# EAGLE board xmagaboard (EAGLE 5.03), part 1 of 2
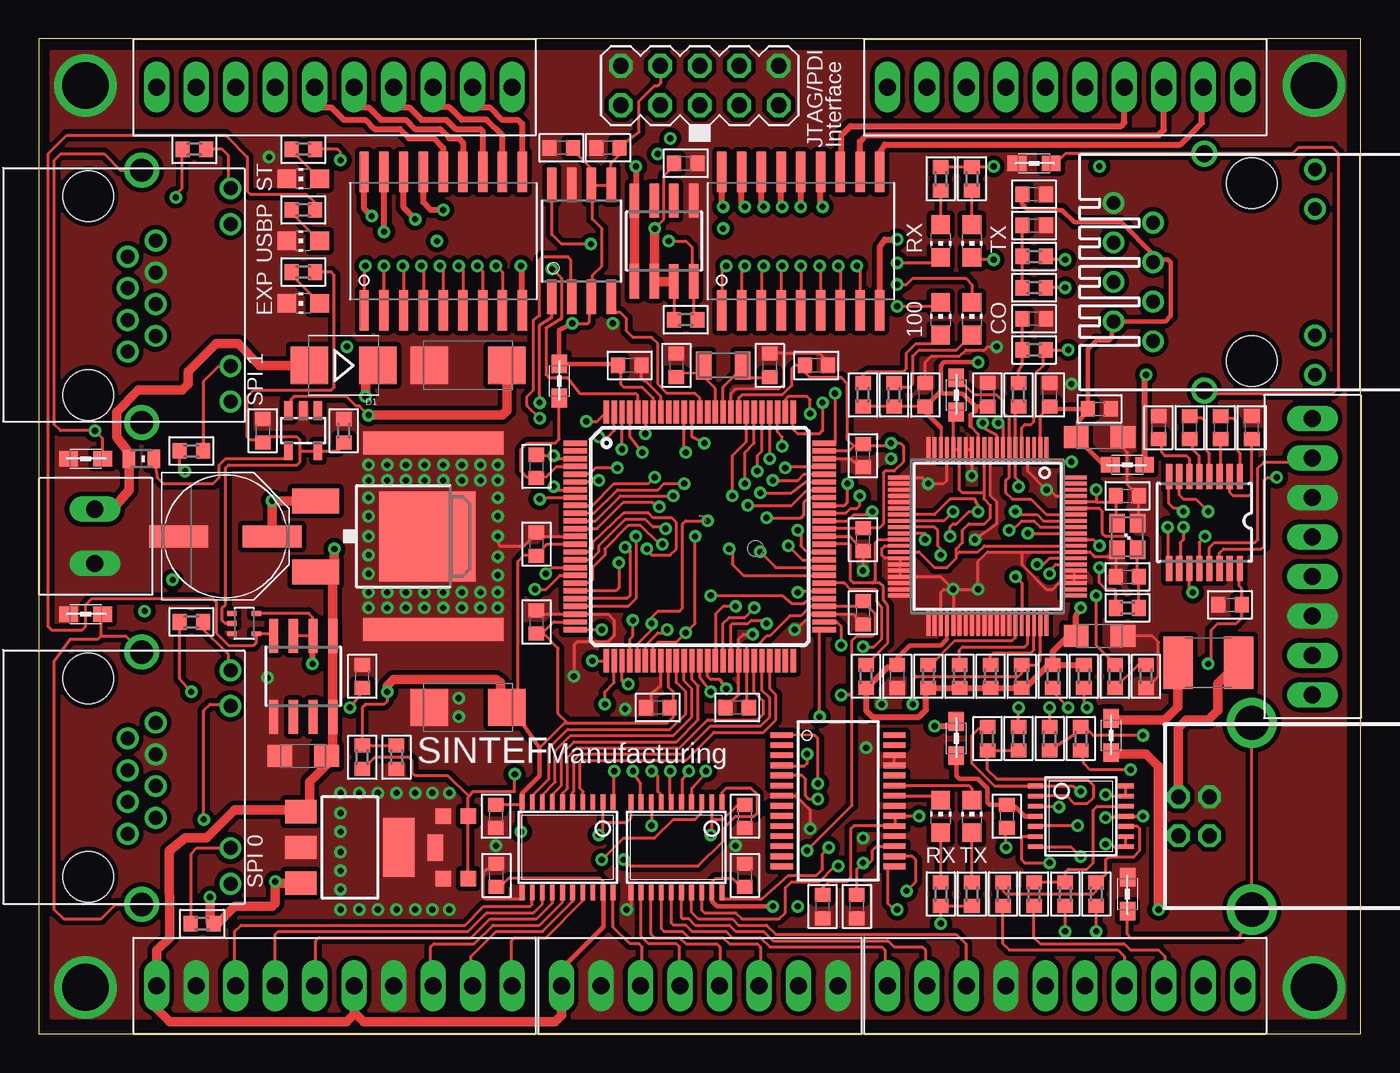
[diagram p2: board, top side]
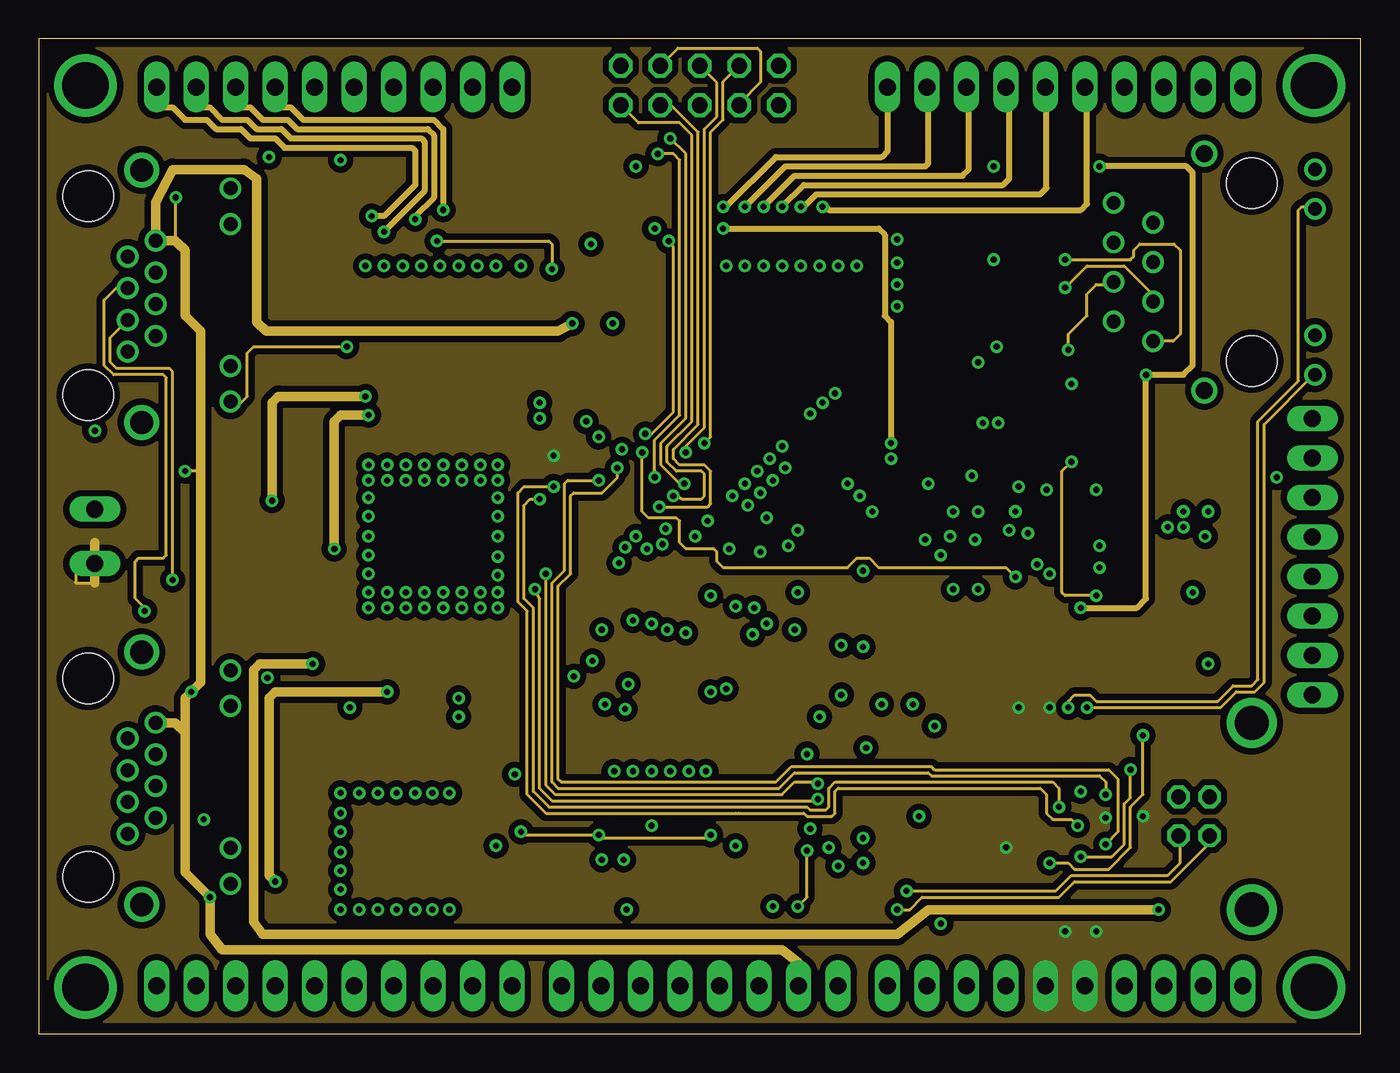
[diagram p3: board, inner layer Route2]
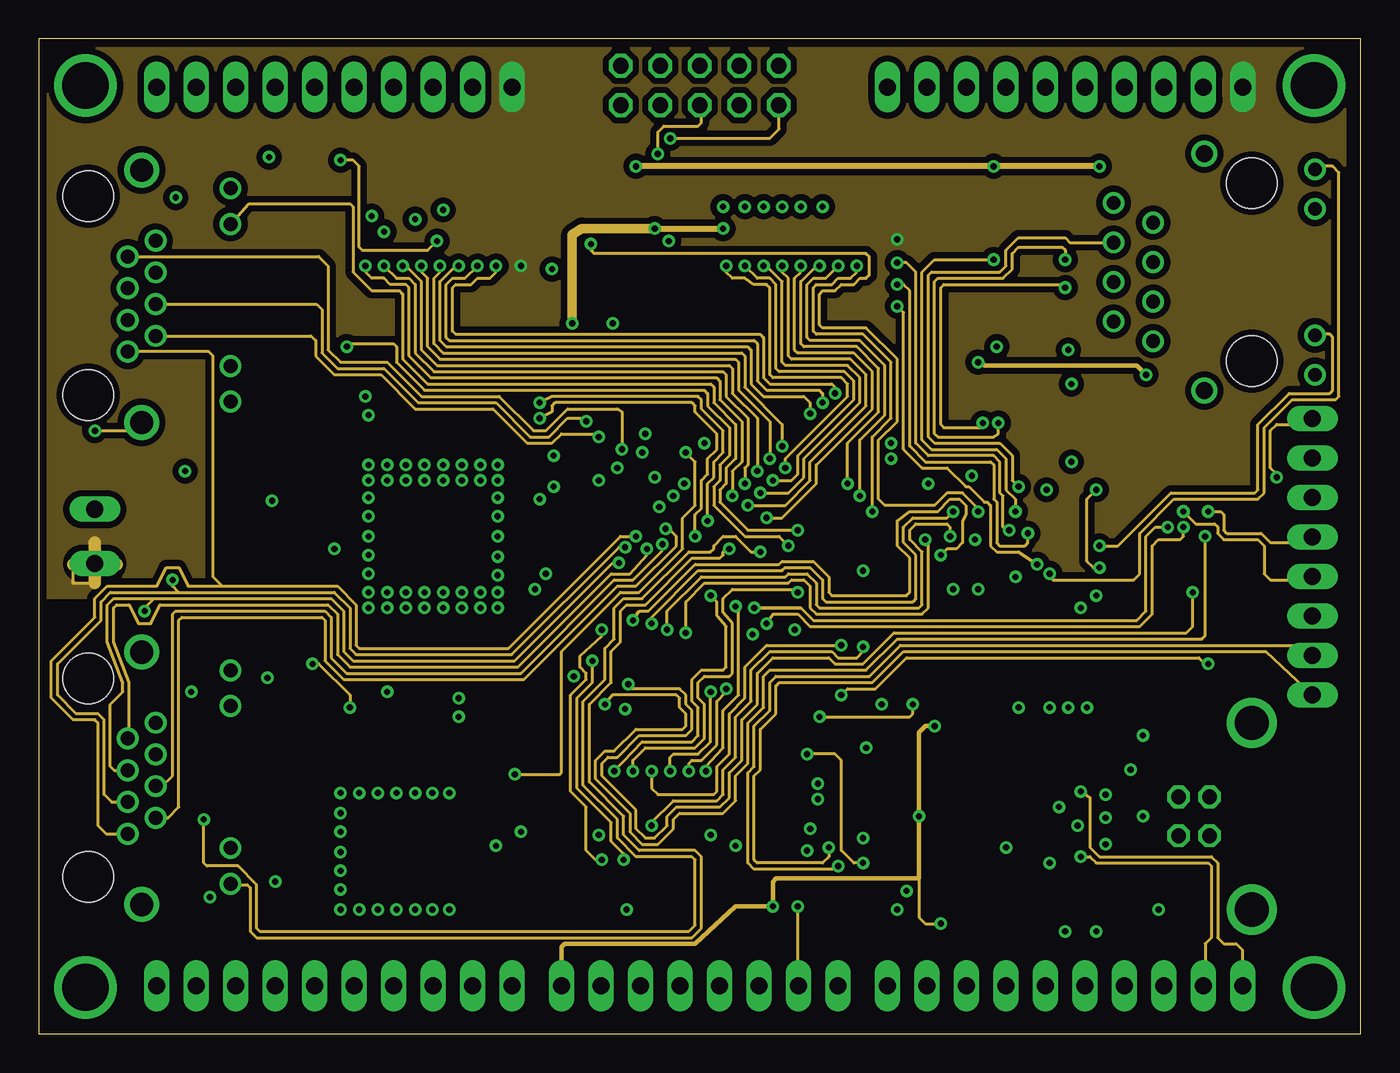
[diagram p4: board, inner layer Route15]
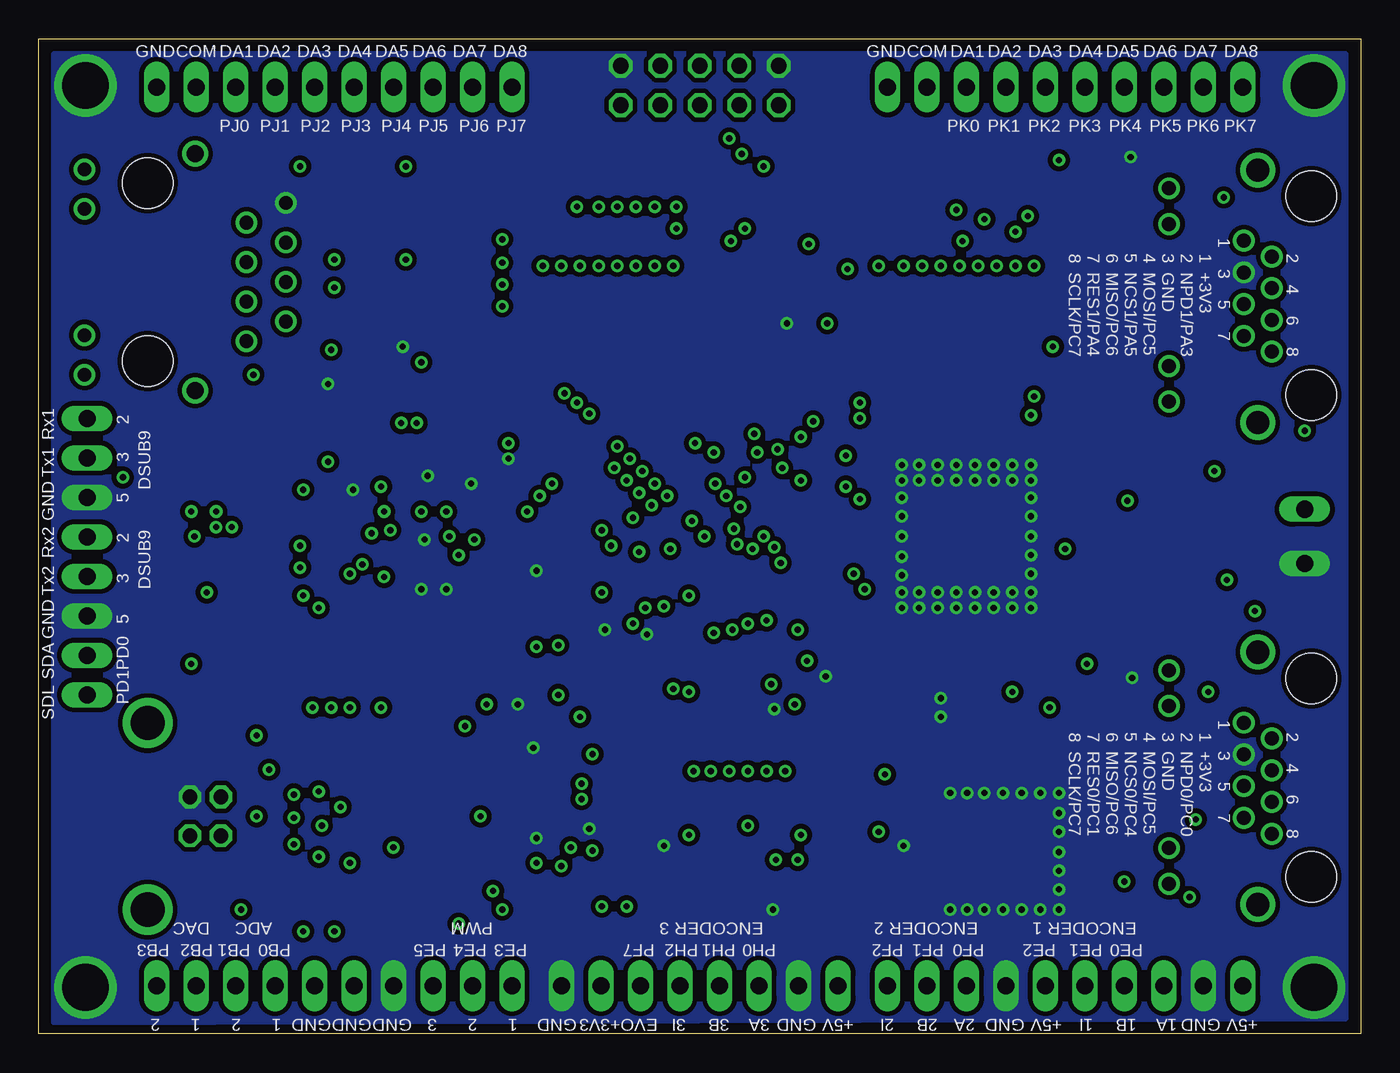
[diagram p5: board, bottom side, seen from below]

Size 85 x 64 mm. Coordinates in mm from the lower left corner, seen from the top.
Outline: 0,0 85,0 85,64 0,64 0,0
Copper layers [2:(1+(2*15)+16):15]: Top 0.035mm / dielectric 0.35mm / Route2 0.035mm / dielectric 0.9mm / Route15 0.035mm / dielectric 0.35mm / Bottom 0.07mm
Design rules "default *": minimum track width 0.15mm, minimum drill 0.4mm, track to track 0.15mm, track to pad 0.15mm, pad to pad 0.15mm, via to via 0.15mm, smd to smd 0.15mm, copper to edge 0mil, drill to drill 0mil, minimum pad ring 10mil, minimum via ring 8mil, stop-mask expansion 0mil, vias tented up to drill 0mil, thermal gap 10mil
Net classes: 1 signal: width 0.254 mm

## Footprints (pad centres in the part's own frame; a part is rotated, then mirrored left to right if it is on the bottom)
PANASONIC_E = smd 3.8 x 1.4: + 3,0; - -3,0
SMC_C = smd 2.4 x 2.4: + -2.5,0; - 2.5,0
C0603 = smd 0.9 x 1: 1 -0.75,0; 2 0.75,0
RCL_SMC_A = smd 1.6 x 1.4: + -1.5,0; - 1.5,0
SMC_A = smd 1.6 x 1.4: + -1.5,0; - 1.5,0
DIODE_SMB = smd 2.4 x 2.4: A 2.2,0; C -2.2,0
DIODE_MICROMELF-R = smd 0.8 x 1.2: A 0.8,0; C -0.8,0
SO18 = smd 0.6 x 2.6: 1 -5.08,-4.45; 2 -3.81,-4.45; 3 -2.54,-4.45; 4 -1.27,-4.45; 5 0,-4.45; 6 1.27,-4.45; 7 2.54,-4.45; 8 3.81,-4.45; 9 5.08,-4.45; 10 5.08,4.45; 11 3.81,4.45; 12 2.54,4.45; 13 1.27,4.45; 14 0,4.45; 15 -1.27,4.45; 16 -2.54,4.45; 17 -3.81,4.45; 18 -5.08,4.45
ETHERNET_SI40138 = drill 0.889 round: 1 -4.445,6.35; 2 -3.175,8.89; 3 -1.905,6.35; 4 -0.635,8.89; 5 0.635,6.35; 6 1.905,8.89; 7 3.175,6.35; 8 4.445,8.89; 9 -6.604,-4.064; 10 -4.064,-4.064; 11 4.064,-4.064; 12 6.604,-4.064 | drill 1.1 round: S1 -7.62,3.048; S2 7.62,3.048 | hole 3.251: -5.715,0; 5.715,0
RCL_L1812 = smd 1.9 x 3.4: 1 -1.95,0; 2 1.95,0
TQFP100 = smd 1.5 x 0.35: 1 -8,6; 2 -8,5.5; 3 -8,5; 4 -8,4.5; 5 -8,4; 6 -8,3.5; 7 -8,3; 8 -8,2.5; 9 -8,2; 10 -8,1.5; 11 -8,1; 12 -8,0.5; 13 -8,0; 14 -8,-0.5; 15 -8,-1; 16 -8,-1.5; 17 -8,-2; 18 -8,-2.5; 19 -8,-3; 20 -8,-3.5; 21 -8,-4; 22 -8,-4.5; 23 -8,-5; 24 -8,-5.5; 25 -8,-6; 51 8,-6; 52 8,-5.5; 53 8,-5; 54 8,-4.5; 55 8,-4; 56 8,-3.5; 57 8,-3; 58 8,-2.5; 59 8,-2; 60 8,-1.5; 61 8,-1; 62 8,-0.5; 63 8,0; 64 8,0.5; 65 8,1; 66 8,1.5; 67 8,2; 68 8,2.5; 69 8,3; 70 8,3.5; 71 8,4; 72 8,4.5; 73 8,5; 74 8,5.5; 75 8,6 | smd 0.35 x 1.5: 26 -6,-8; 27 -5.5,-8; 28 -5,-8; 29 -4.5,-8; 30 -4,-8; 31 -3.5,-8; 32 -3,-8; 33 -2.5,-8; 34 -2,-8; 35 -1.5,-8; 36 -1,-8; 37 -0.5,-8; 38 0,-8; 39 0.5,-8; 40 1,-8; 41 1.5,-8; 42 2,-8; 43 2.5,-8; 44 3,-8; 45 3.5,-8; 46 4,-8; 47 4.5,-8; 48 5,-8; 49 5.5,-8; 50 6,-8; 76 6,8; 77 5.5,8; 78 5,8; 79 4.5,8; 80 4,8; 81 3.5,8; 82 3,8; 83 2.5,8; 84 2,8; 85 1.5,8; 86 1,8; 87 0.5,8; 88 0,8; 89 -0.5,8; 90 -1,8; 91 -1.5,8; 92 -2,8; 93 -2.5,8; 94 -3,8; 95 -3.5,8; 96 -4,8; 97 -4.5,8; 98 -5,8; 99 -5.5,8; 100 -6,8
SMARTPRJ_SQFP-S-10X10-80 = smd 0.25 x 1.6: 1 -3.8,-5.6; 2 -3.4,-5.6; 3 -3,-5.6; 4 -2.6,-5.6; 5 -2.2,-5.6; 6 -1.8,-5.6; 7 -1.4,-5.6; 8 -1,-5.6; 9 -0.6,-5.6; 10 -0.2,-5.6; 11 0.2,-5.6; 12 0.6,-5.6; 13 1,-5.6; 14 1.4,-5.6; 15 1.8,-5.6; 16 2.2,-5.6; 17 2.6,-5.6; 18 3,-5.6; 19 3.4,-5.6; 20 3.8,-5.6; 41 3.8,5.6; 42 3.4,5.6; 43 3,5.6; 44 2.6,5.6; 45 2.2,5.6; 46 1.8,5.6; 47 1.4,5.6; 48 1,5.6; 49 0.6,5.6; 50 0.2,5.6; 51 -0.2,5.6; 52 -0.6,5.6; 53 -1,5.6; 54 -1.4,5.6; 55 -1.8,5.6; 56 -2.2,5.6; 57 -2.6,5.6; 58 -3,5.6; 59 -3.4,5.6; 60 -3.8,5.6 | smd 1.6 x 0.25: 21 5.6,-3.8; 22 5.6,-3.4; 23 5.6,-3; 24 5.6,-2.6; 25 5.6,-2.2; 26 5.6,-1.8; 27 5.6,-1.4; 28 5.6,-1; 29 5.6,-0.6; 30 5.6,-0.2; 31 5.6,0.2; 32 5.6,0.6; 33 5.6,1; 34 5.6,1.4; 35 5.6,1.8; 36 5.6,2.2; 37 5.6,2.6; 38 5.6,3; 39 5.6,3.4; 40 5.6,3.8; 61 -5.6,3.8; 62 -5.6,3.4; 63 -5.6,3; 64 -5.6,2.6; 65 -5.6,2.2; 66 -5.6,1.8; 67 -5.6,1.4; 68 -5.6,1; 69 -5.6,0.6; 70 -5.6,0.2; 71 -5.6,-0.2; 72 -5.6,-0.6; 73 -5.6,-1; 74 -5.6,-1.4; 75 -5.6,-1.8; 76 -5.6,-2.2; 77 -5.6,-2.6; 78 -5.6,-3; 79 -5.6,-3.4; 80 -5.6,-3.8
SMARTPRJ_SSOP28 = smd 0.381 x 1.499: 1 -4.225,-3.625; 2 -3.575,-3.625; 3 -2.925,-3.625; 4 -2.275,-3.625; 5 -1.625,-3.625; 6 -0.975,-3.625; 7 -0.325,-3.625; 8 0.325,-3.625; 9 0.975,-3.625; 10 1.625,-3.625; 11 2.275,-3.625; 12 2.925,-3.625; 13 3.575,-3.625; 14 4.225,-3.625; 15 4.225,3.625; 16 3.575,3.625; 17 2.925,3.625; 18 2.275,3.625; 19 1.625,3.625; 20 0.975,3.625; 21 0.325,3.625; 22 -0.325,3.625; 23 -0.975,3.625; 24 -1.625,3.625; 25 -2.275,3.625; 26 -2.925,3.625; 27 -3.575,3.625; 28 -4.225,3.625
SO08WIDE = smd 0.61 x 2.21: 1 -1.905,-3.6; 2 -0.635,-3.6; 3 0.635,-3.6; 4 1.905,-3.6; 5 1.905,3.6; 6 0.635,3.6; 7 -0.635,3.6; 8 -1.905,3.6
TSSOP16 = smd 0.4 x 1.6: 1 -2.225,-2.85; 2 -1.575,-2.85; 3 -0.925,-2.85; 4 -0.275,-2.85; 5 0.375,-2.85; 6 1.025,-2.85; 7 1.675,-2.85; 8 2.325,-2.85; 9 2.325,3.05; 10 1.675,3.05; 11 1.025,3.05; 12 0.375,3.05; 13 -0.275,3.05; 14 -0.925,3.05; 15 -1.575,3.05; 16 -2.225,3.05
TSSOP20 = smd 0.305 x 0.991: 1 -2.925,-2.918; 2 -2.275,-2.918; 3 -1.625,-2.918; 4 -0.975,-2.918; 5 -0.325,-2.918; 6 0.325,-2.918; 7 0.975,-2.918; 8 1.625,-2.918; 9 2.275,-2.918; 10 2.925,-2.918; 11 2.925,2.918; 12 2.275,2.918; 13 1.625,2.918; 14 0.975,2.918; 15 0.325,2.918; 16 -0.325,2.918; 17 -0.975,2.918; 18 -1.625,2.918; 19 -2.275,2.918; 20 -2.925,2.918
SOT323-5 = smd 0.305 x 0.61: 1 -0.65,-0.8; 2 0,-0.8; 3 0.65,-0.8; 4 0.65,0.8; 5 -0.65,0.8
2X05 = drill 1.016 octagon: 1 -5.08,-1.27; 2 -5.08,1.27; 3 -2.54,-1.27; 4 -2.54,1.27; 5 0,-1.27; 6 0,1.27; 7 2.54,-1.27; 8 2.54,1.27; 9 5.08,-1.27; 10 5.08,1.27
WUERTH-ELEKTRONIK_0805 = smd 1.2 x 1: 1 -1.1,0; 2 1.1,0
LED_CHIP-LED0805 = smd 1.2 x 1.2: A 0,-1.05; C 0,1.05
TSSOP14 = smd 0.305 x 0.991: 1 -1.95,-2.918; 2 -1.3,-2.918; 3 -0.65,-2.918; 4 0,-2.918; 5 0.65,-2.918; 6 1.3,-2.918; 7 1.95,-2.918; 8 1.95,2.918; 9 1.3,2.918; 10 0.65,2.918; 11 0,2.918; 12 -0.65,2.918; 13 -1.3,2.918; 14 -1.95,2.918
FC-135 = smd 1 x 1.8: P$1 -1.25,0; P$2 1.25,0
CFPX-181 = smd 1.2 x 1: 1 -0.85,-0.65; 2 0.85,-0.65; 3 0.85,0.65; 4 -0.85,0.65
SO-08 = smd 0.6 x 2.2: 1 -1.905,-2.6; 2 -0.635,-2.6; 3 0.635,-2.6; 4 1.905,-2.6; 5 1.905,2.6; 6 0.635,2.6; 7 -0.635,2.6; 8 -1.905,2.6
R0603 = smd 0.9 x 1: 1 -0.75,0; 2 0.75,0
KMR211G = smd 1 x 1: 1 2,0.8; 2 2,-0.8; 3 -2,0.8; 4 -2,-0.8 | smd 1.7 x 1: 5 0,1.3
WR-CON_JR45 = drill 0.9 round: 1 -1.02,0; 2 0,-1.78; 3 1.02,0; 4 2.04,-1.78; 5 3.06,0; 6 4.08,-1.78; 7 5.1,0; 8 6.12,-1.78; ANGR 7.045,4.82; ANOR -4.385,4.82; CATGR 9.335,4.82; CATOR -2.095,4.82 | drill 1.5 round: GND1 -5.56,-0.89; GND2 10.675,-0.89 | hole 3.25: -3.875,-4.32; 8.9,-4.32
SMARTPRJ_PN61729 = drill 0.95 octagon: 1 1.25,4.71; 2 -1.25,4.71; 3 -1.25,2.71; 4 1.25,2.71 | drill 2.2 round: P$1 -6,0; P$2 6,0
DPACK = smd 1.6 x 3: 1 -2.28,-4.8; 3 2.28,-4.8 | smd 5.8 x 6.2: 4 0,2.38 | smd 1.47 x 9.02: TPAD1 -5.995,2.765; TPAD2 5.995,2.765
SOT223 = smd 1.5 x 2: 1 -2.3,-3.15; 2 0,-3.15; 3 2.3,-3.15 | smd 3.8 x 2: GND 0,3.15
SOT23-5L = smd 0.55 x 1.2: 1 -0.95,-1.3; 2 0,-1.3; 3 0.95,-1.3; 4 0.95,1.3; 5 -0.95,1.3
MTP05_10_254 = drill 1.1 long: 1 -11.43,0; 2 -8.89,0; 3 -6.35,0; 4 -3.81,0; 5 -1.27,0; 6 1.27,0; 7 3.81,0; 8 6.35,0; 9 8.89,0; 10 11.43,0
MTP05_8_254 = drill 1.1 long: 1 -8.89,0; 2 -6.35,0; 3 -3.81,0; 4 -1.27,0; 5 1.27,0; 6 3.81,0; 7 6.35,0; 8 8.89,0
MKDS1_2_35 = drill 1.1 long: 1 -1.75,0; 2 1.75,0

## Placement (x,y rotation side)
C1  100u  [PANASONIC_E]  12,32 0 top
C2  47u  [SMC_C]  27.6,43 180 top
C3  47u  [SMC_C]  27.6,21 180 top
C4  100n  [C0603]  20.8,23 90 top
C5  100n  [C0603]  64,54 0 top
C6  100n  [C0603]  64,52 180 top
C7  100n  [C0603]  64,46 0 top
C8  18p  [C0603]  70,29.4 180 top
C9  18p  [C0603]  70,34.6 0 top
C10  10u  [RCL_SMC_A]  68.2,25.6 0 top
C11  100n  [C0603]  61,41.1 270 top
C12  10u  [RCL_SMC_A]  68.2,38.4 0 top
C13  100n  [C0603]  55.2,23 90 top
C14  100n  [C0603]  68.2,40.2 180 top
C15  100n  [C0603]  65,41.1 270 top
C16  100n  [C0603]  76,39 270 top
C17  100n  [C0603]  74,39 270 top
C18  100n  [C0603]  78,39 90 top
C19  100n  [C0603]  72,39 270 top
C20  100n  [C0603]  76.6,27.6 180 top
C21  100n  [C0603]  57,41.1 270 top
C22  100n  [C0603]  50.4,8.2 90 top
C23  100n  [C0603]  52.6,8.2 90 top
C24  100n  [C0603]  41.6,56 180 top
C25  100n  [C0603]  38,43 0 top
C26  100n  [C0603]  50,43 0 top
C27  100n  [C0603]  53,37.2 90 top
C28  100n  [C0603]  53,31.8 90 top
C29  100n  [C0603]  53,27.1 90 top
C30  100n  [C0603]  44.9,21 0 top
C31  100n  [C0603]  39.8,21 0 top
C32  100n  [C0603]  32,26.5 270 top
C33  100n  [C0603]  32,31.5 270 top
C34  100n  [C0603]  32,36.5 270 top
C35  100n  [C0603]  36.6,57 0 top
C37  100n  [C0603]  33.6,57 180 top
C38  18p  [C0603]  41,43 270 top
C39  18p  [C0603]  47,43 270 top
C40  100n  [C0603]  14.4,38.8 270 top
C41  100n  [C0603]  62.25,14 90 top
C43  100n  [C0603]  29.43,10.2 90 top
C44  100n  [C0603]  45.4,10.2 90 top
C45  100n  [C0603]  45.4,14 270 top
C46  100n  [C0603]  29.4,14 270 top
C47  10u  [SMC_A]  17,17.88 180 top
D1  [DIODE_SMB]  19.6,43 180 top
D2  [DIODE_MICROMELF-R]  6.6,37 180 top
DA1  ULN2803  [SO18]  26,51 0 top
DA2  ULN2803  [SO18]  49,51 0 top
ETH1  ETHERNET_SI-40138  [ETHERNET_SI40138]  78,49 90 top
F1  500 ma  [RCL_L1812]  75.2,23.88 180 top
IC1  XMEGA128A1-AU  [TQFP100]  42.5,32 0 top
IC2  SMARTPRJ_W5100  [SMARTPRJ_SQFP-S-10X10-80]  61,32 180 top
IC3  SMARTPRJ_FT232RL  [SMARTPRJ_SSOP28]  51.4,15 270 top
IC4  ATMEL_DATA_FLASH  [SO08WIDE]  34.9,51 0 top
IC5  MAX3232CUE+  [TSSOP16]  75,33 180 top
IC6  TXB0108  [TSSOP20]  34,12 180 top
IC7  TXB0108  [TSSOP20]  41,12 180 top
IC8  74LX1G04  [SOT323-5]  13.2,26.4 270 top
JTAG  [2X05]  42.5,61 0 top
L1  1uH  [WUERTH-ELEKTRONIK_0805]  64,56 180 top
L2  1uH  [WUERTH-ELEKTRONIK_0805]  59,41.1 270 top
L3  1uH  [WUERTH-ELEKTRONIK_0805]  70,36.6 0 top
L4  1uH  [WUERTH-ELEKTRONIK_0805]  68.95,19.2 270 top
L5  1uH  [WUERTH-ELEKTRONIK_0805]  33.46,42 270 top
L6  1uH  [WUERTH-ELEKTRONIK_0805]  3,27 180 top
L7  1uH  [WUERTH-ELEKTRONIK_0805]  3,37 180 top
L8  1uH  [WUERTH-ELEKTRONIK_0805]  70,9 90 top
L9  1uH  [WUERTH-ELEKTRONIK_0805]  59,19 270 top
LED1  [LED_CHIP-LED0805]  58,14 0 top
LED2  [LED_CHIP-LED0805]  60,14 0 top
LED3  [LED_CHIP-LED0805]  17,55 90 top
LED4  [LED_CHIP-LED0805]  60,51 180 top
LED5  [LED_CHIP-LED0805]  58,51 180 top
LED6  [LED_CHIP-LED0805]  60,46 0 top
LED7  [LED_CHIP-LED0805]  17,51 90 top
LED8  [LED_CHIP-LED0805]  17,47 90 top
LED9  [LED_CHIP-LED0805]  58,46 0 top
OPA1  TLV2374  [TSSOP14]  67,14 270 top
OSC1  FC135  [FC-135]  44,43 180 top
OSC2  CFXP-181  [CFPX-181]  70,32 90 top
PS1  LTC1777CS8  [SO-08]  17,23 180 top
PS2  LTC1777CS8  [SO-08]  40.2,51 0 top
R1  10K  [R0603]  19.6,38.8 90 top
R2  50R  [R0603]  64,50 0 top
R3  50R  [R0603]  64,48 0 top
R4  50R  [R0603]  64,44 180 top
R5  50R  [R0603]  63,41.1 90 top
R6  470R  [R0603]  67.2,23 270 top
R7  470R  [R0603]  65.2,23 270 top
R8  300 (1%)  [R0603]  71.2,23 90 top
R9  12K (1%)  [R0603]  69.2,23 90 top
R10  1K  [R0603]  58,9 90 top
R11  1M  [R0603]  70,27.4 180 top
R12  1K  [R0603]  60,9 90 top
R13  470R  [R0603]  60,55 90 top
R14  470R  [R0603]  58,55 90 top
R15  470R  [R0603]  55,41.1 270 top
R16  10K  [R0603]  20.8,17.8 270 top
R17  4.7K  [R0603]  41.6,45.94 180 top
R18  470R  [R0603]  17,56.9 0 top
R19  1K  [R0603]  17,53 0 top
R20  1K  [R0603]  17,49 0 top
R21  470R  [R0603]  53,41.1 270 top
R22  470R  [R0603]  9.8,26.5 180 top
R23  470R  [R0603]  10.5,7.1 0 top
R24  470R  [R0603]  10,56.9 180 top
R25  470R  [R0603]  9.8,37.5 180 top
R26  4.7K  [R0603]  62,9 90 top
R27  9.1K  [R0603]  68,9 270 top
R28  9.1K  [R0603]  66,9 270 top
R29  4.7K  [R0603]  64,9 270 top
R30  4.7K  [R0603]  61,19 90 top
R31  9.1K  [R0603]  63,19 270 top
R32  9.1K  [R0603]  65,19 90 top
R33  4.7K  [R0603]  67,19 90 top
R34  10K  [R0603]  23,17.8 90 top
R35  4.7K  [R0603]  63.2,23 270 top
R36  4.7K  [R0603]  53.2,23 90 top
R37  4.7K  [R0603]  61.2,23 270 top
R38  4.7K  [R0603]  59.2,23 270 top
R39  4.7K  [R0603]  57.2,23 270 top
S1  KMR211G  [KMR211G]  26.81,12 90 top
SPI0  WR-COM-RJ45  [WR-CON_JR45]  7.5,19 270 top
SPI1  WR-COM-RJ45  [WR-CON_JR45]  7.5,50 270 top
USB  [SMARTPRJ_PN61729]  78,14 90 top
VREG1  LD29150DT50T  [DPACK]  22.6,32 270 top
VREG2  LM39040IMP_3V3  [SOT223]  20,12 270 top
VREG3  LM3490  [SOT23-5L]  17,38.8 180 top
X1  MTP05_10_254  [MTP05_10_254]  19,3.1 0 top
X2  MTP05_8_254  [MTP05_8_254]  42.5,3.1 0 top
X3  MTP05_10_254  [MTP05_10_254]  66,3.1 0 top
X4  MTP05_8_254  [MTP05_8_254]  81.9,30.7 270 top
X5  MTP05_10_254  [MTP05_10_254]  66,60.9 0 top
X7  MTP05_10_254  [MTP05_10_254]  19,60.9 0 top
X8  MKDS1_2_35  [MKDS1_2_35]  3.6,32 270 top